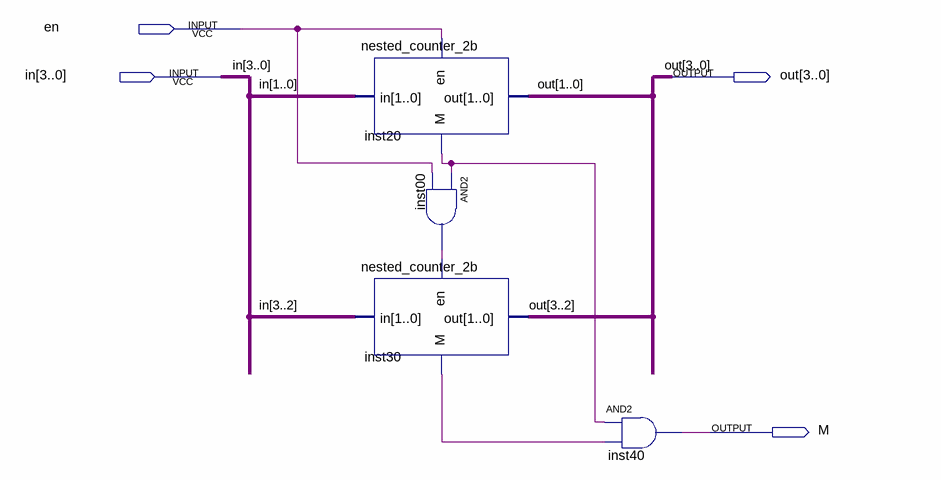
[diagram p0: schematic sheet]
// Quartus schematic nested_counter_4b.bdf as structural Verilog: 4 symbols, 4 pins
module nested_counter_4b (
  input  en,
  input  [3:0] in,
  output [3:0] out,
  output M
);

  wire inst00_out, inst20_m, inst30_m;

  nested_counter_2b inst20 (.en(en), .in(in[1:0]), .out(out[1:0]), .M(inst20_m));
  and inst00 (inst00_out, inst20_m, en);
  nested_counter_2b inst30 (.en(inst00_out), .in(in[3:2]), .out(out[3:2]), .M(inst30_m));
  and inst40 (M, inst20_m, inst30_m);
endmodule
